# Altium project 自动控温2.PrjPcb
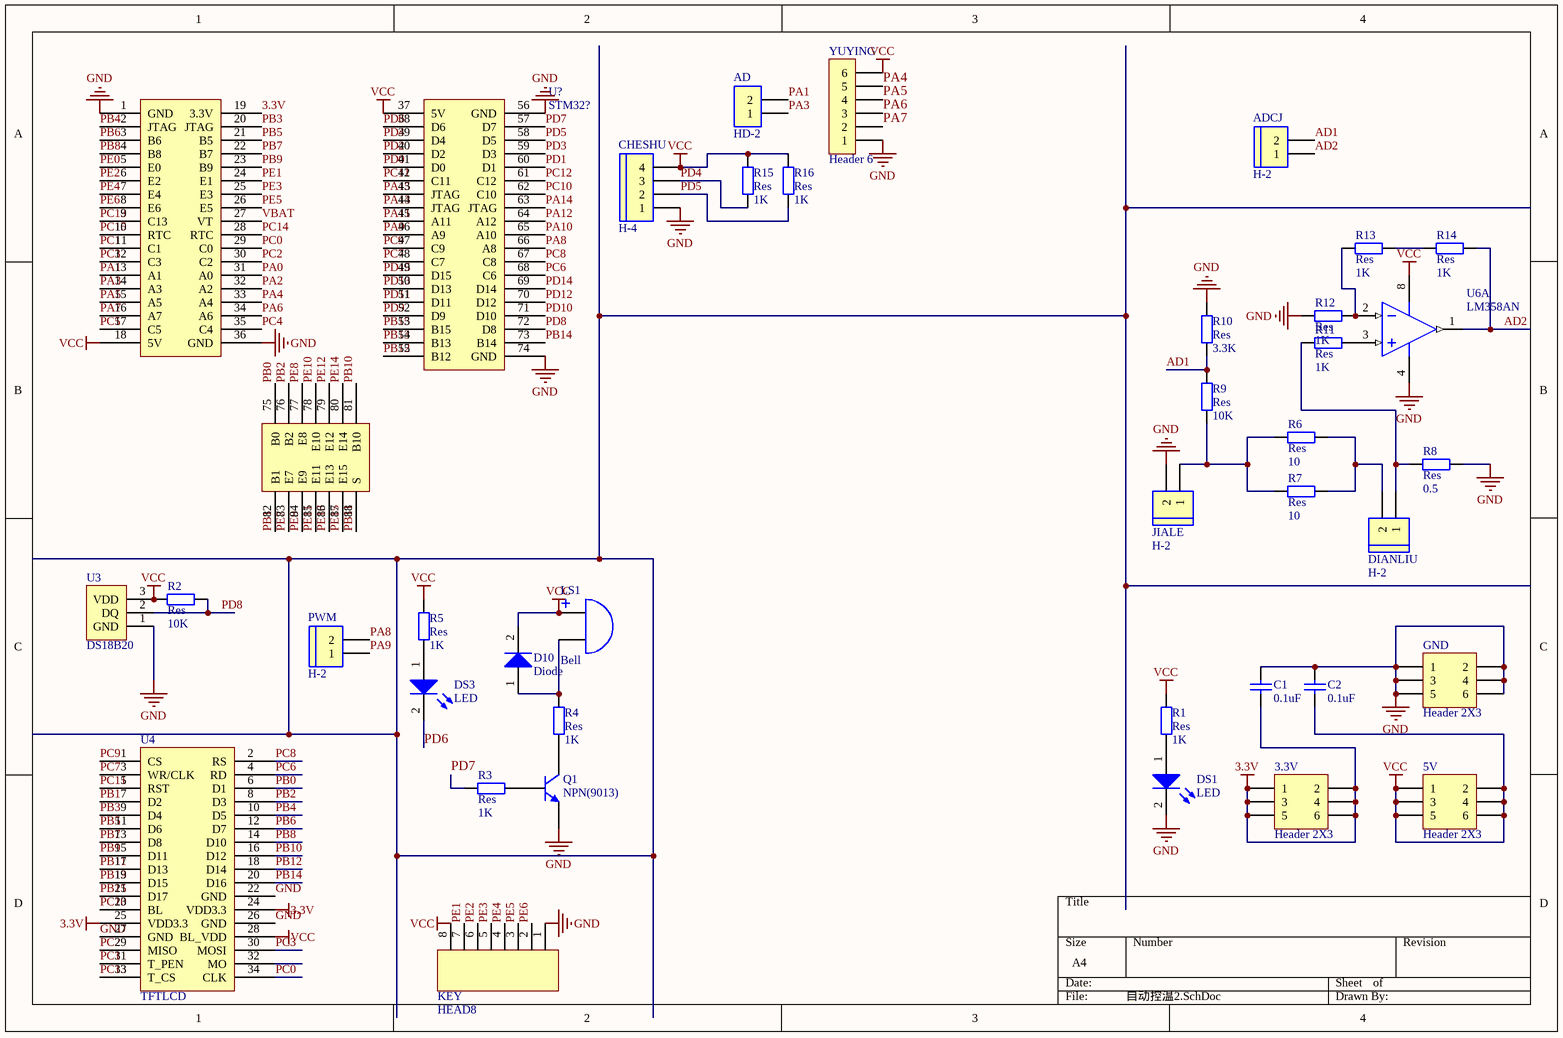
[diagram p0: 自动控温2.SchDoc]
1 sheet, 38 parts. Net scope: global (net labels, ports and power ports of the same name join across sheets).
Board file: 自动控温2.PcbDoc

## Sheet 自动控温2.SchDoc
size A4

### Parts
3.3V  Header 2X3  [HDR2-3]
5V  Header 2X3  [HDR2-3]
AD  HD-2  [HT2]
ADCJ  H-2  [H-2/2-T]
C1  value 0.1uF  [CC1005-0402]  (hidden comment: CAP)
C2  value 0.1uF  [CC1005-0402]  (hidden comment: CAP)
CHESHU  H-4  [H-4/4 -T]
D10  Diode  [1n4148]
DIANLIU  H-2  [H-2/2-T]
DS1  LED  [LED0.1-0.22]
DS3  LED  [LED0.1-0.22]
GND  Header 2X3  [HDR2-3]
JIALE  H-2  [H-2/2-T]
KEY  HEAD8  [HEAD8M - C 1]
LS1  Bell  [BELL0.3-0.46]
PWM  H-2  [H-2/2-T]
Q1  NPN(9013)  [BCY-3]
R1  Res  value 1K  [AXLAL0.4]
R2  Res  value 10K  [R2012-0805]
R3  Res  value 1K  [R2012-0805]
R4  Res  value 1K  [R2012-0805]
R5  Res  value 1K  [R2012-0805]
R6  Res  value 10  [AXLAL0.4]
R7  Res  value 10  [AXLAL0.4]
R8  Res  value 0.5  [AXLAL0.4]
R9  Res  value 10K  [AXLAL0.4]
R10  Res  value 3.3K  [AXLAL0.4]
R11  Res  value 1K  [R2012-0805]
R12  Res  value 1K  [R2012-0805]
R13  Res  value 1K  [R2012-0805]
R14  Res  value 1K  [R2012-0805]
R15  Res  value 1K  [AXLAL0.4]
R16  Res  value 1K  [AXLAL0.4]
U3  DS18B20  [BCY-3]
U4  TFTLCD  [TFTLCD]
U6  LM358AN  [DIP8]  (part A of 2)
U?  STM32?  [STM32_MIN]
YUYING  Header 6  [HDR1-6]

### Nets
3.3V: 3.3V.1 3.3V.2 3.3V.3 3.3V.4 3.3V.5 3.3V.6 C1.1 U4.24(VDD3.3) U4.25(VDD3.3) U?.19(3.3V)
GND: C1.2 C2.2 CHESHU.1 DS1.2(K) GND.1 GND.2 GND.3 GND.4 GND.5 GND.6 JIALE.2 KEY.1 Q1.3(E) R8.2 R10.2 R12.1 U3.1(GND) U4.22(GND) U4.26(GND) U4.27(GND) U6.4(GND) U?.1(GND) U?.36(GND) U?.56(GND) U?.74(GND) YUYING.1
VCC: 5V.1 5V.2 5V.3 5V.4 5V.5 5V.6 C2.1 CHESHU.4 D10.2(K) KEY.8 LS1.1(A) R1.2 R2.1 R5.1 R15.2 R16.2 U3.3(VDD) U4.28(BL_VDD) U6.8(V+) U?.18(5V) U?.37(5V) YUYING.6
AD1: ADCJ.2 R9.2 R10.1
AD2: ADCJ.1 R14.2 U6.1(OUT)
PA0: U?.31(A0)
PA1: AD.2 U?.13(A1)
PA2: U?.32(A2)
PA3: AD.1 U?.14(A3)
PA4: U?.33(A4) YUYING.5
PA5: U?.15(A5) YUYING.4
PA6: U?.34(A6) YUYING.3
PA7: U?.16(A7) YUYING.2
PA8: PWM.2 U?.66(A8)
PA9: PWM.1 U?.46(A9)
PA10: U?.65(A10)
PA11: U?.45(A11)
PA12: U?.64(A12)
PA13: U?.44(JTAG)
PA14: U?.63(JTAG)
PA15: U?.43(JTAG)
PB0: U4.6(D1) U?.75(B0)
PB1: U4.7(D2) U?.82(B1)
PB2: U4.8(D3) U?.76(B2)
PB3: U4.9(D4) U?.20(JTAG)
PB4: U4.10(D5) U?.2(JTAG)
PB5: U4.11(D6) U?.21(B5)
PB6: U4.12(D7) U?.3(B6)
PB7: U4.13(D8) U?.22(B7)
PB8: U4.14(D10) U?.4(B8)
PB9: U4.15(D11) U?.23(B9)
PB10: U4.16(D12) U?.81(B10)
PB11: U4.17(D13) U?.88(S)
PB12: U4.18(D14) U?.55(B12)
PB13: U4.19(D15) U?.54(B13)
PB14: U4.20(D16) U?.73(B14)
PB15: U4.21(D17) U?.53(B15)
PC0: U4.34(CLK) U?.29(C0)
PC1: U4.31(T_PEN) U?.11(C1)
PC2: U4.29(MISO) U?.30(C2)
PC3: U4.30(MOSI) U?.12(C3)
PC4: U?.35(C4)
PC5: U?.17(C5)
PC6: U4.4(RD) U?.68(C6)
PC7: U4.3(WR/CLK) U?.48(C7)
PC8: U4.2(RS) U?.67(C8)
PC9: U4.1(CS) U?.47(C9)
PC10: U4.23(BL) U?.62(C10)
PC11: U4.5(RST) U?.42(C11)
PC12: U?.61(C12)
PC13: U4.33(T_CS) U?.9(C13)
PC14: U?.28(RTC)
PC15: U?.10(RTC)
PD0: U?.41(D0)
PD1: U?.60(D1)
PD2: U?.40(D2)
PD3: U?.59(D3)
PD4: CHESHU.3 R15.1 U?.39(D4)
PD5: CHESHU.2 R16.1 U?.58(D5)
PD6: DS3.2(K) U?.38(D6)
PD7: R3.1 U?.57(D7)
PD8: R2.2 U3.2(DQ) U?.72(D8)
PD9: U?.52(D9)
PD10: U?.71(D10)
PD11: U?.51(D11)
PD12: U?.70(D12)
PD13: U?.50(D13)
PD14: U?.69(D14)
PD15: U?.49(D15)
PE0: U?.5(E0)
PE1: KEY.7 U?.24(E1)
PE2: KEY.6 U?.6(E2)
PE3: KEY.5 U?.25(E3)
PE4: KEY.4 U?.7(E4)
PE5: KEY.3 U?.26(E5)
PE6: KEY.2 U?.8(E6)
PE7: U?.83(E7)
PE8: U?.77(E8)
PE9: U?.84(E9)
PE10: U?.78(E10)
PE11: U?.85(E11)
PE12: U?.79(E12)
PE13: U?.86(E13)
PE14: U?.80(E14)
PE15: U?.87(E15)
VBAT: U?.27(VT)
NetD10_1: D10.1(A) LS1.2(B) R4.1
NetDIANLIU_1: DIANLIU.1 R8.1 R11.1
NetDIANLIU_2: DIANLIU.2 R6.2 R7.2
NetDS1_1: DS1.1(A) R1.1
NetDS3_1: DS3.1(A) R5.2
NetJIALE_1: JIALE.1 R6.1 R7.1 R9.1
NetQ1_1: Q1.1(C) R4.2
NetQ1_2: Q1.2(B) R3.2
NetR11_2: R11.2 U6.3(IN+)
NetR12_2: R12.2 R13.1 U6.2(IN-)
NetR13_2: R13.2 R14.1

Not connected (* = marked no-connect by the designer): U4 32(MO)

### Library data of the parts
3.3V 5V GND = Header 2X3: Header, 3-Pin, Dual row; Manufacturer: Generic Components; Class: Connector
AD = HD-2: Header, 2-Pin; Manufacturer: Generic Components; Class: Connector
ADCJ DIANLIU JIALE PWM = H-2: Header, 2-Pin; Manufacturer: Generic Components; Class: Connector
C1 C2 = CAP: Capacitor; Manufacturer: Generic Components; Class: Passive; Published: 08/06/2000; Publisher: Altium Hobart Technology Centre; SubClass: Capacitor
CHESHU = H-4: Header, 4-Pin; Manufacturer: Generic Components; Class: Connector
D10 = Diode: Default Diode; Manufacturer: Generic Components; Class: Discrete; SubClass: Diode - Switching; Published: 08/06/2000; Publisher: Altium Hobart Technology Centre
DS1 DS3 = LED: Typical RED, GREEN, YELLOW, AMBER GaAs LED; Manufacturer: Generic Components; Class: Optoelectronic; Published: 08/06/2000; Publisher: Altium Hobart Technology Centre; SubClass: LED
KEY = HEAD8: Connector,8-pin; Class: Connector
LS1 = Bell: Electrical Bell; Manufacturer: Generic Components; Published: 1999
Q1 = NPN(9013): NPN Bipolar Transistor; Manufacturer: Generic Components; Class: Discrete; SubClass: BJT - Low Power; Published: 08/06/2000; Publisher: Altium Hobart Technology Centre
R1-R16 = Res: Resistor; Manufacturer: Generic Components; Class: Passive; Published: 08/06/2000; Publisher: Altium Hobart Technology Centre; SubClass: Resistor
U3 = DS18B20: Programmable Resolution / 1-Wire Digital Thermometer
U6 = LM358AN: Low-Power Dual Operational Amplifier; Manufacturer: National Semiconductor; Published: 15/04/2002; Publisher: Altium Hobart Technology Centre; Class: Amplifier; SubClass: Operational Amplifier
U? = STM32_MIN
YUYING = Header 6: Header, 6-Pin; Manufacturer: Generic Components; Class: Connector